# Altium schematic sheet LED OSRAM.SchDoc
size A
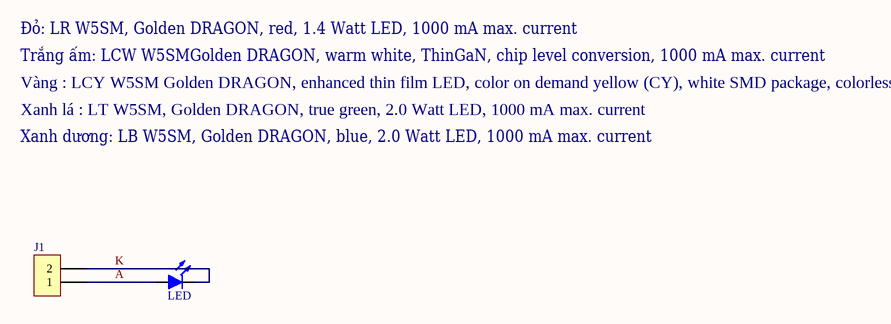
[diagram p0: LED OSRAM.SchDoc]

## Parts
J1  Jump đực loại cong, 2 chân 2.54mm, hàn dán như bản vẽ  [HDR1x2]  (value not drawn)
LED  LED osram, hàn đúng mã, đúng cực, đáy LED dán silicon truyền nhiệt hoặc bôi keo tản nhiệt  [OSRAM_GOLDENDRAGON]  (value not drawn)

## Nets
A: J1.1 LED.A
K: J1.2 LED.K

## Notes on the sheet
- Đỏ: LR W5SM, Golden DRAGON, red, 1.4 Watt LED, 1000 mA max. current
- Trắng ấm: LCW W5SMGolden DRAGON, warm white, ThinGaN, chip level conversion, 1000 mA max. current
- Vàng : LCY W5SM Golden DRAGON, enhanced thin film LED, color on demand yellow (CY), white SMD package, colorless clear silicone
- Xanh lá : LT W5SM, Golden DRAGON, true green, 2.0 Watt LED, 1000 mA max. current
- Xanh dương: LB W5SM, Golden DRAGON, blue, 2.0 Watt LED, 1000 mA max. current

## Library data of the parts
J1 = CON2: Type1: Giắc xanh loại nằm, 300V/16A - 5.08mm; Type2: Jump đực loại thẳng, 2.54mm; Type3: Jumper; Type4: Giắc xanh loại nằm, 300V/16A - 3.81mm; Value: 2P; Type5: Jump đực loại cong, 2 chân 2.54mm, hàn dán như bản vẽ
LED = Led